# EAGLE design ybox2 (EAGLE 5.08)
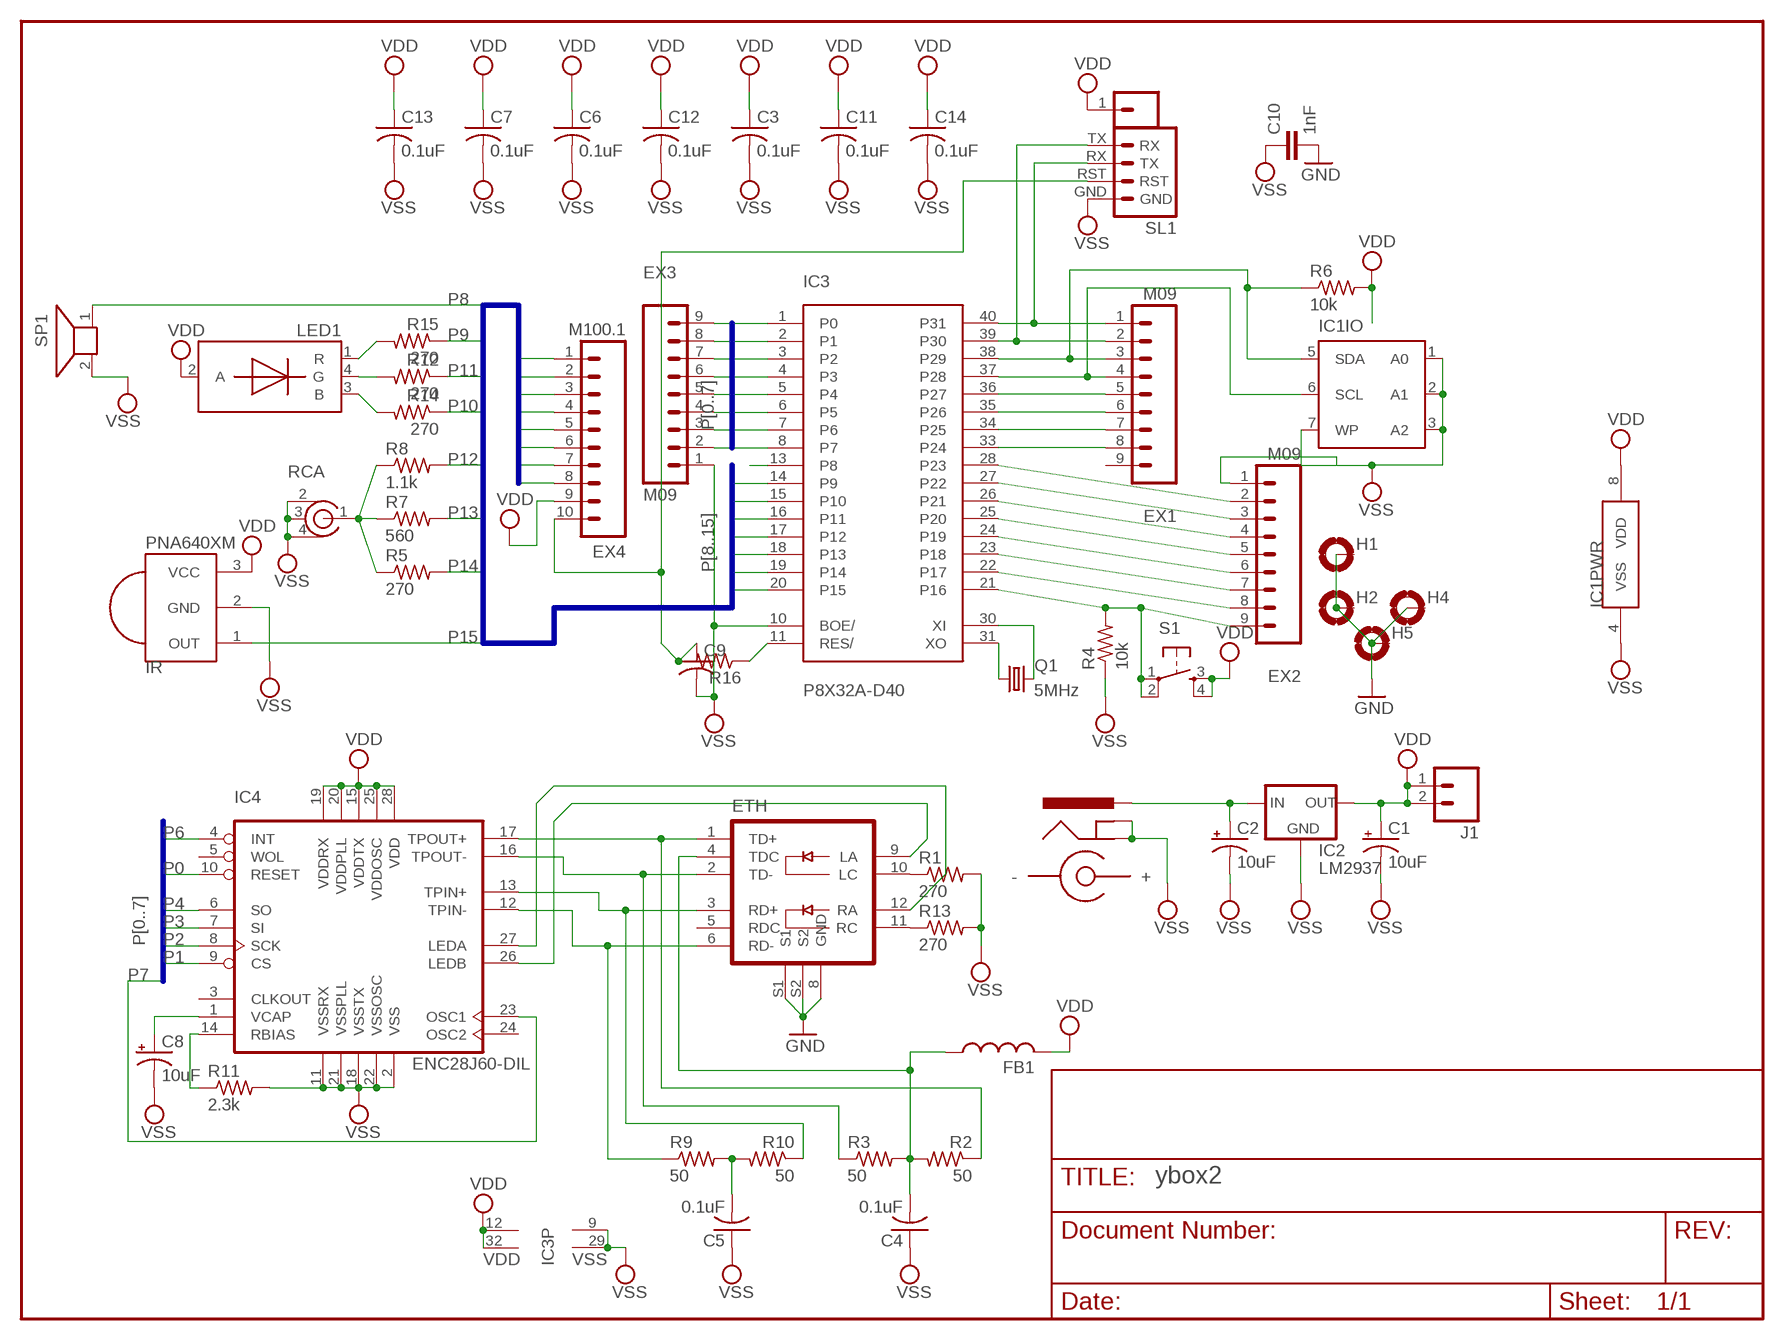
[diagram p0: schematic, sheet 1]

## Parts
C1  10uF  CAP_POLPTH2  [CPOL-RADIAL-10UF-25V]
C2  10uF  CAP_POLPTH2  [CPOL-RADIAL-10UF-25V]
C3  0.1uF  C-US025-024X044  [C025-024X044]
C4  0.1uF  C-US025-024X044  [C025-024X044]
C5  0.1uF  C-US025-024X044  [C025-024X044]
C6  0.1uF  C-US025-024X044  [C025-024X044]
C7  0.1uF  C-US025-024X044  [C025-024X044]
C8  10uF  CAP_POLPTH2  [CPOL-RADIAL-10UF-25V]
C9  C-US025-024X044  [C025-024X044]
C10  1nF  C-EU025-024X044  [C025-024X044]
C11  0.1uF  C-US025-024X044  [C025-024X044]
C12  0.1uF  C-US025-024X044  [C025-024X044]
C13  0.1uF  C-US025-024X044  [C025-024X044]
C14  0.1uF  C-US025-024X044  [C025-024X044]
ETH  J00-0065NL  J0026  [PJ-J0]
EX1  M09  [1X09]
EX2  M09  [1X09]
EX3  M09  [1X09]
EX4  M100.1  [1X10]
FB1  L-US0207/2V  [0207/2V]
H1  MOUNT-PAD-ROUND2.8  [2,8-PAD]
H2  MOUNT-PAD-ROUND2.8  [2,8-PAD]
H4  MOUNT-PAD-ROUND2.8  [2,8-PAD]
H5  MOUNT-PAD-ROUND2.8  [2,8-PAD]
IC1  24LC256AA65P  [DIL8]
IC2  LM2937  V_REG_78XXSIDE  [78XXL]
IC3  P8X32A-D40  P8X32AD40  [DIP40]
IC4  ENC28J60-DIL  [DIL28-3]
IR  PNA640XM  [PNA460XM]
J1  M02PTH  [1X02]
LED1  LED-RGB-CA  [LED5MMRGB]
PWR  POWER_JACKPTH  [POWER_JACK_PTH]
Q1  5MHz  CRYSTALHC49UV  [HC49U-V]
R1  270  R-US_0204/7  [0204/7]
R2  50  R-US_0204/2V  [0204V]
R3  50  R-US_0204/2V  [0204V]
R4  10k  R-US_0204/7  [0204/7]
R5  270  R-US_0204/7  [0204/7]
R6  10k  R-US_0204/7  [0204/7]
R7  560  R-US_0204/7  [0204/7]
R8  1.1k  R-US_0204/7  [0204/7]
R9  50  R-US_0204/2V  [0204V]
R10  50  R-US_0204/2V  [0204V]
R11  2.3k  R-US_0204/7  [0204/7]
R12  270  R-US_0207/10  [0207/10]
R13  270  R-US_0204/7  [0204/7]
R14  270  R-US_0207/10  [0207/10]
R15  270  R-US_0207/10  [0207/10]
R16  R-US_0204/7  [0204/7]
RCA  RCA-JACK  [RJC-014]
S1  TAC_SWITCHPTH  [TACTILE-PTH]
SL1  PROPPLUGCLIP  [PROPCLIP]
SP1  SPEAKER/AL60P  [AL60P]
U$1  6V  POLARITY  [CENTER-POS]
VDD  M01PTH  [1X01]

## Nets
6V: C2.1(+) IC2.IN PWR.PWR
GND: C10.2 ETH.8(GND) ETH.S1 ETH.S2 H1.B2,8(MOUNT) H2.B2,8(MOUNT) H4.B2,8(MOUNT) H5.B2,8(MOUNT)
N$1: EX1.2 IC3.39(P30) SL1.TX(RX)
N$2: EX1.1 IC3.40(P31) SL1.RX(TX)
N$4: IC3.31(XO) Q1.1
N$5: C5.2 R9.2 R10.2
N$6: LED1.1(R) R15.2
N$7: EX1.3 IC1.5(IO:SDA) IC3.38(P29) R6.1
N$8: EX1.4 IC1.6(IO:SCL) IC3.37(P28)
N$9: LED1.3(B) R14.2
N$10: LED1.4(G) R12.2
N$11: IC3.11(RES/) R16.1
N$12: C9.1 EX4.10 R16.2 SL1.RST
N$19: R5.1 R7.1 R8.1 RCA.1(SIG)
N$21: ETH.3(RD+) IC4.13(TPIN+) R10.1
N$22: ETH.6(RD-) IC4.12(TPIN-) R9.1
N$23: ETH.2(TD-) IC4.16(TPOUT-) R3.1
N$24: ETH.1(TD+) IC4.17(TPOUT+) R2.1
N$25: EX1.5 IC3.36(P27)
N$26: IC3.30(XI) Q1.2
N$28: IC4.14(RBIAS) R11.1
N$29: C8.1(+) IC4.1(VCAP)
N$36: EX1.6 IC3.35(P26)
N$38: EX1.7 IC3.34(P25)
N$39: EX1.8 IC3.33(P24)
N$40: EX2.8 IC3.22(P17)
N$41: EX2.7 IC3.23(P18)
N$42: EX2.6 IC3.24(P19)
N$43: EX2.5 IC3.25(P20)
N$44: EX2.4 IC3.26(P21)
N$45: EX2.3 IC3.27(P22)
N$46: EX2.2 IC3.28(P23)
N$49: ETH.12(RA) IC4.27(LEDA)
N$50: ETH.9(LA) IC4.26(LEDB)
N$51: ETH.10(LC) R1.1
N$52: ETH.11(RC) R13.1
N$53: C4.2 ETH.4(TDC) FB1.1 R2.2 R3.2
P0: EX3.9 IC3.1(P0) IC4.10(RESET)
P1: EX3.8 IC3.2(P1) IC4.9(CS)
P2: EX3.7 IC3.3(P2) IC4.8(SCK)
P3: EX3.6 IC3.4(P3) IC4.7(SI)
P4: EX3.5 IC3.5(P4) IC4.6(SO)
P5: EX3.4 IC3.6(P5)
P6: EX3.3 IC3.7(P6) IC4.4(INT)
P7: EX3.2 IC3.8(P7) IC4.23(OSC1)
P8: EX4.8 IC3.13(P8) SP1.1(+)
P9: EX4.7 IC3.14(P9) R15.1
P10: EX4.6 IC3.15(P10) R14.1
P11: EX4.5 IC3.16(P11) R12.1
P12: EX4.4 IC3.17(P12) R8.2
P13: EX4.3 IC3.18(P13) R7.2
P14: EX4.2 IC3.19(P14) R5.2
P15: EX4.1 IC3.20(P15) IR.1(OUT)
P16: EX2.9 IC3.21(P16) R4.2 S1.1 S1.2
VDD: C1.1(+) C3.1 C6.1 C7.1 C11.1 C12.1 C13.1 C14.1 EX4.9 FB1.2 IC1.8(PWR:VDD) IC2.OUT IC3.12(VDD) IC3.32(VDD) IC4.15(VDDTX) IC4.19(VDDRX) IC4.20(VDDPLL) IC4.25(VDDOSC) IC4.28(VDD) IR.3(VCC) J1.1 J1.2 LED1.2(A) R6.2 S1.3 S1.4 VDD.1
VSS: C1.2(-) C2.2(-) C3.2 C4.1 C5.1 C6.2 C7.2 C8.2(-) C9.2 C10.1 C11.2 C12.2 C13.2 C14.2 EX2.1 EX3.1 IC1.1(IO:A0) IC1.2(IO:A1) IC1.3(IO:A2) IC1.4(PWR:VSS) IC1.7(IO:WP) IC2.GND IC3.9(VSS) IC3.10(BOE/) IC3.29(VSS) IC4.2(VSS) IC4.11(VSSRX) IC4.18(VSSTX) IC4.21(VSSPLL) IC4.22(VSSOSC) IR.2(GND) PWR.GND PWR.GNDBREAK R1.2 R4.1 R11.2 R13.2 RCA.2(GND1) RCA.3(GND2) RCA.4(GND3) SL1.GND SP1.2(-)
Unconnected: ETH.5(RDC) EX1.9 IC4.3(CLKOUT) IC4.5(WOL) IC4.24(OSC2)

## Buses
P[0..7]
P[8..15]

## Notes on the sheet
- - | +
- ybox2

## Library data of the parts
C1 C2 C8 = SparkFunEagle-6-6-07:CAP_POL: Capacitor Polarized These are standard SMD and PTH capacitors. Normally 10uF, 47uF, and 100uF in electrolytic and tantalum varieties. Always verify the external diameter of the through hole cap, it varies with capacity, voltage, and manufacturer. The EIA devices should be standard.
C3-C7 C9 C11-C14 = rcl:C-US: CAPACITOR, American symbol
C10 = rcl:C-EU: CAPACITOR, European symbol
ETH = con-pulse:J0026: RJ45 PulseJack w/LEDs
EX1-EX3 = SparkFunEagle-6-6-07:M09: Header 9 Standard 9-pin 0.1" header. Use with straight break away headers (SKU : PRT-00116), right angle break away headers (PRT-00553), swiss pins (PRT-00743), machine pins (PRT-00117), and female headers (PRT-00115).
EX4 = SparkFunEagle-6-6-07:M10: Header 10 Standard 10-pin 0.1" header. Use with straight break away headers (SKU : PRT-00116), right angle break away headers (PRT-00553), swiss pins (PRT-00743), machine pins (PRT-00117), and female headers (PRT-00115).
FB1 = 0common:L-US: INDUCTOR, American symbol
H1 H2 H4 H5 = holes:MOUNT-PAD-ROUND: MOUNTING PAD, round
IC1 = 0common:24LC256: Serial EEPROM 32 K/64 K, 1.8 V, I2C
IC2 = SparkFunEagle-6-6-07:V_REG_78XX: Voltage Regulator Standard 7805 5V regulator. IGO (Input Ground Output). Spark Fun Electronics SKU : COM-00107
IC3 = 0common:P8X32A
IC4 = microchip-enc28j60:ENC28J60-*: Microchip 10Mbit Eth. contoller with SPI interface
IR = 0common:PNA640XM
J1 = SparkFunEagle-6-6-07:M02: Header 2 Standard 2-pin 0.1" header. Use with straight break away headers (SKU : PRT-00116), right angle break away headers (PRT-00553), swiss pins (PRT-00743), machine pins (PRT-00117), and female headers (PRT-00115). Molex polarized connector foot print use with SKU : PRT-08233 with associated crimp pins and housings.
LED1 = 0common:LED-RGB-CA
PWR = SparkFunEagle-6-6-07:POWER_JACK: Power Jack This is the standard 5.5mm barrel jack for power. The PTH is the most common, proven, reliable, footprint. All others are experimental. The Slot footprint only works if the mill layer is transmitted to the PCB fab house so be warned. Spark Fun Electronics SKU : PRT-00119. Mating wall wart : TOL-00298 (and others)
Q1 = SparkFunEagle-6-6-07:CRYSTAL: Crystals Various standard crystals. Proven footprints. Spark Fun Electronics SKU : COM-00534
R1 R4-R8 R12-R16 = 0common:R-US_: RESISTOR, American symbol
R2 R3 R9-R11 = rcl:R-US_: RESISTOR, American symbol
RCA = 0common:RCA-JACK
S1 = 0common:TAC_SWITCH: Momentary Switch Button commonly used for reset or general input. Spark Fun Electronics SKU : COM-00097
SL1 = 0common:PROPPLUG: Header 4 Standard 4-pin 0.1" header. Use with straight break away headers (SKU : PRT-00116), right angle break away headers (PRT-00553), swiss pins (PRT-00743), machine pins (PRT-00117), and female headers (PRT-00115). Molex polarized connector foot print use with SKU : PRT-08231 with associated crimp pins and housings.
SP1 = 0common:SPEAKER: SPEAKER Source: Buerklin
U$1 = 0common:POLARITY
VDD = SparkFunEagle-6-6-07:M01: Header 1 Standard 1-pin 0.1" header. Use with straight break away headers (SKU : PRT-00116), right angle break away headers (PRT-00553), swiss pins (PRT-00743), machine pins (PRT-00117), and female headers (PRT-00115).

## Net classes
0 default: width 0.406 mm

## Board
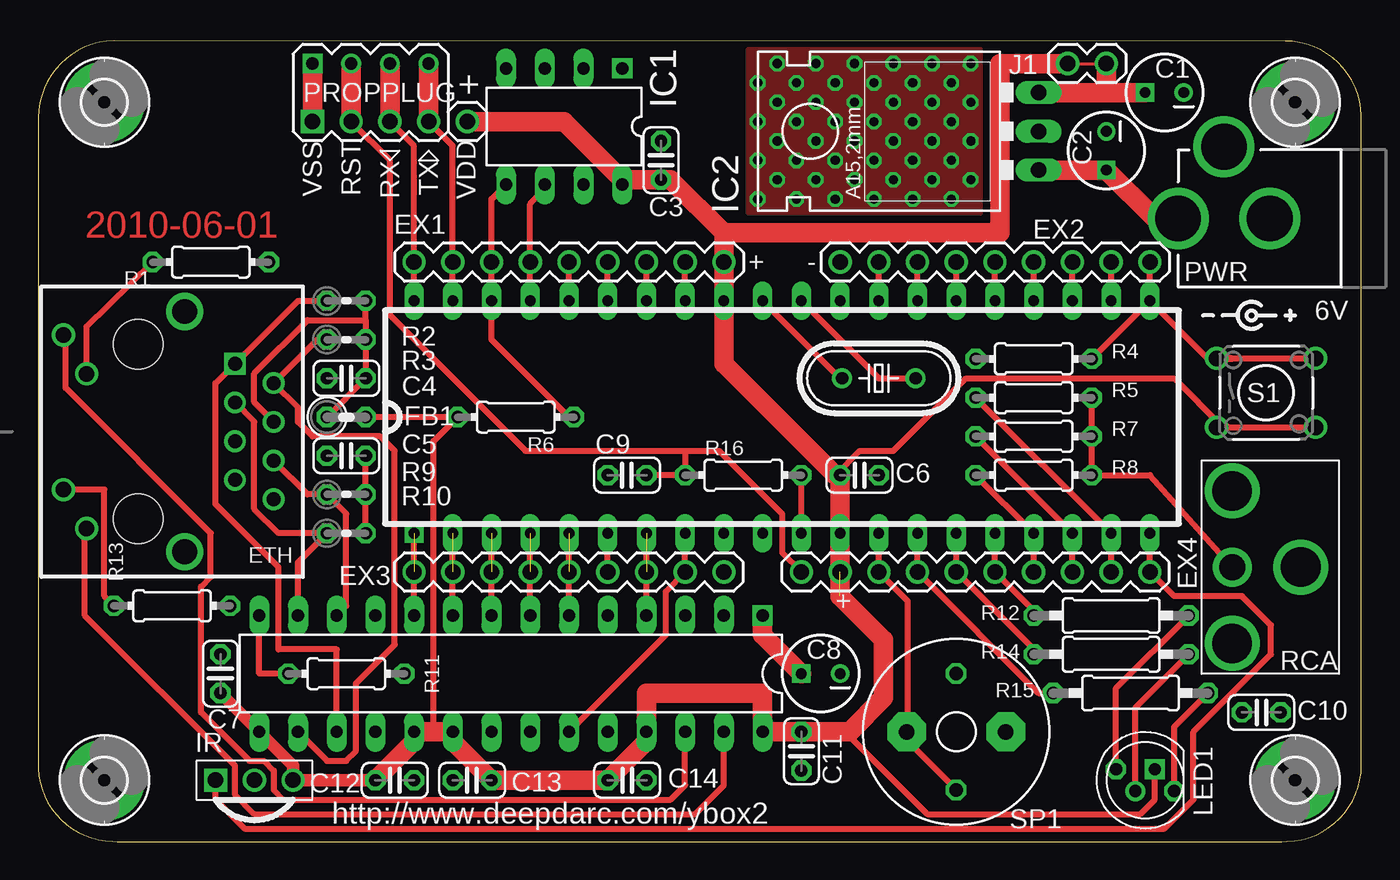
[diagram p1: board, top side]
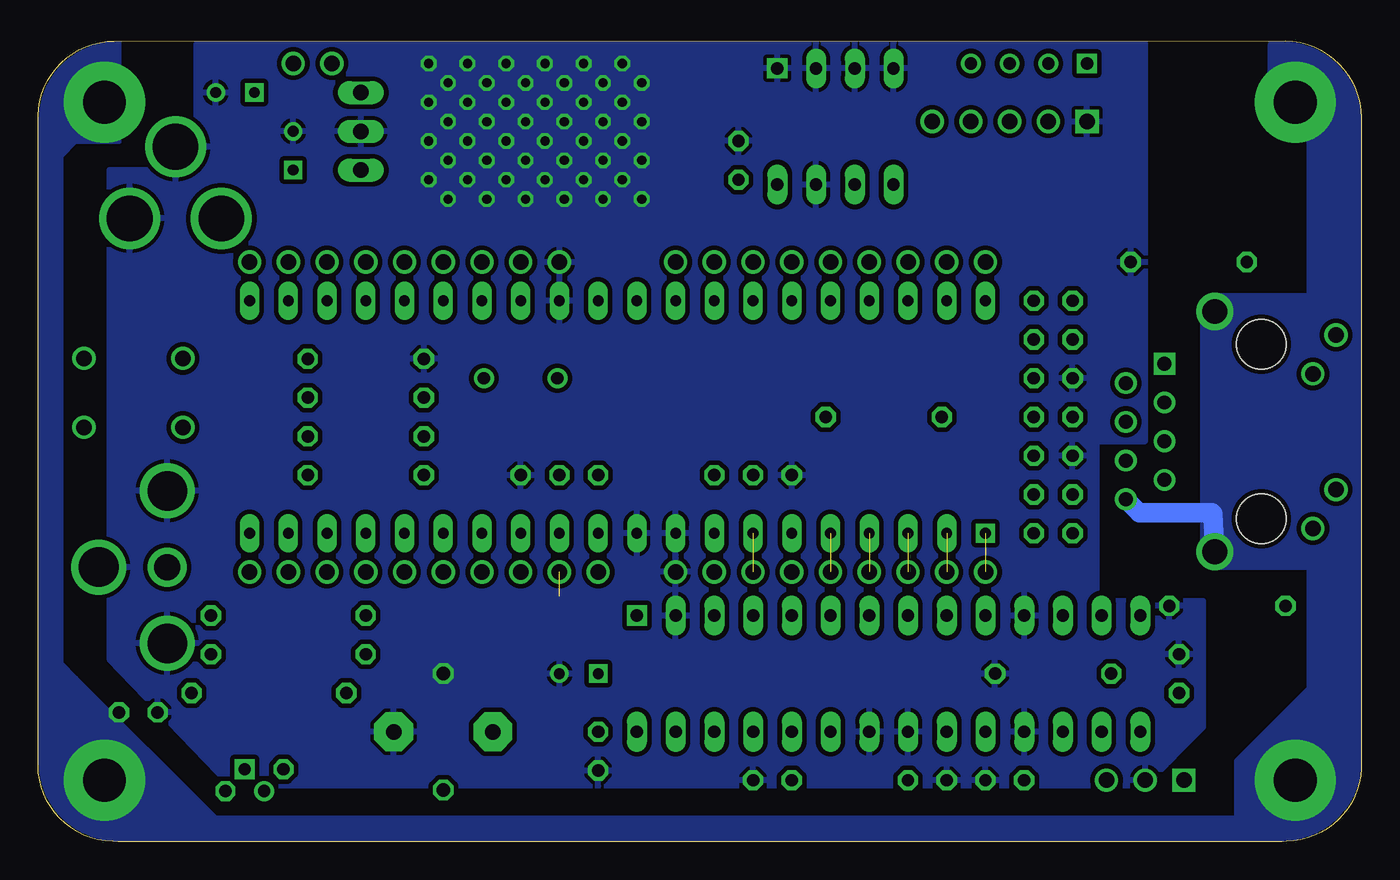
[diagram p2: board, bottom side, seen from below]

Size 86.79 x 52.5 mm. Coordinates in mm from the lower left corner, seen from the top.
Outline: 5.2,0 81.58,0 81.91,0.01 arc89 86.79,5.01 86.79,47.29 86.78,47.59 arc89 81.79,52.48 4.99,52.5 arc89 0,47.46 0,47.28 0.01,5.27 arc92 4.9,0.01 5.2,0
Copper layers (1*16): Top 0.035mm / dielectric 1.5mm / Bottom 0.035mm
Design rules "default": minimum track width 8mil, minimum drill 24mil, track to track 8mil, track to pad 8mil, pad to pad 8mil, via to via 8mil, smd to smd 8mil, copper to edge 0mil, drill to drill 8mil, minimum pad ring 10mil, minimum via ring 8mil, stop-mask expansion 4mil, vias tented up to drill 0mil, thermal gap 10mil

### Footprints (pad centres in the part's own frame; a part is rotated, then mirrored left to right if it is on the bottom)
CPOL-RADIAL-10UF-25V = drill 0.7 square: 1 1.27,0 | drill 0.7 round: 2 -1.27,0
C025-024X044 = drill 0.813 octagon: 1 -1.27,0; 2 1.27,0
PJ-J0 = drill 0.914 square: 1 4.445,-6.35 | drill 0.914 round: 2 3.175,-8.89; 3 1.905,-6.35; 4 0.635,-8.89; 5 -0.635,-6.35; 6 -1.905,-8.89; 7 -3.175,-6.35; 8 -4.445,-8.89 | drill 1.016 round: 9 6.325,4.902; 10 3.785,3.378; 11 -3.81,4.902; 12 -6.35,3.378 | drill 1.626 round: S1 -7.874,-3.048; S2 7.874,-3.048 | hole 3.251: -5.715,0; 5.715,0
1X09 = drill 1.016 round: 1 0,0; 2 2.54,0; 3 5.08,0; 4 7.62,0; 5 10.16,0; 6 12.7,0; 7 15.24,0; 8 17.78,0; 9 20.32,0
1X10 = drill 1.016 round: 1 0,0; 2 2.54,0; 3 5.08,0; 4 7.62,0; 5 10.16,0; 6 12.7,0; 7 15.24,0; 8 17.78,0; 9 20.32,0; 10 22.86,0
0207/2V = drill 0.813 octagon: 1 -1.27,0; 2 1.27,0
2,8-PAD = drill 2.8 pad 5.334 round: B2,8 0,0
DIL8 = drill 0.813 square: 1 -3.81,-3.81 | drill 0.813 long: 2 -1.27,-3.81; 3 1.27,-3.81; 4 3.81,-3.81; 5 3.81,3.81; 6 1.27,3.81; 7 -1.27,3.81; 8 -3.81,3.81
78XXL = drill 1.016 long: GND 0,-3.81; IN -2.54,-3.81; OUT 2.54,-3.81
DIP40 = drill 0.7 pad 1.27 square: 1 -7.62,23.495 | drill 0.7 pad 1.27 long: 2 -7.62,20.955; 3 -7.62,18.415; 4 -7.62,15.875; 5 -7.62,13.335; 6 -7.62,10.795; 7 -7.62,8.255; 8 -7.62,5.715; 9 -7.62,3.175; 10 -7.62,0.635; 11 -7.62,-1.905; 12 -7.62,-4.445; 13 -7.62,-6.985; 14 -7.62,-9.525; 15 -7.62,-12.065; 16 -7.62,-14.605; 17 -7.62,-17.145; 18 -7.62,-19.685; 19 -7.62,-22.225; 20 -7.62,-24.765; 21 7.62,-24.765; 22 7.62,-22.225; 23 7.62,-19.685; 24 7.62,-17.145; 25 7.62,-14.605; 26 7.62,-12.065; 27 7.62,-9.525; 28 7.62,-6.985; 29 7.62,-4.445; 30 7.62,-1.905; 31 7.62,0.635; 32 7.62,3.175; 33 7.62,5.715; 34 7.62,8.255; 35 7.62,10.795; 36 7.62,13.335; 37 7.62,15.875; 38 7.62,18.415; 39 7.62,20.955; 40 7.62,23.495
DIL28-3 = drill 0.813 square: 1 -16.51,-3.81 | drill 0.813 long: 2 -13.97,-3.81; 3 -11.43,-3.81; 4 -8.89,-3.81; 5 -6.35,-3.81; 6 -3.81,-3.81; 7 -1.27,-3.81; 8 1.27,-3.81; 9 3.81,-3.81; 10 6.35,-3.81; 11 8.89,-3.81; 12 11.43,-3.81; 13 13.97,-3.81; 14 16.51,-3.81; 15 16.51,3.81; 16 13.97,3.81; 17 11.43,3.81; 18 8.89,3.81; 19 6.35,3.81; 20 3.81,3.81; 21 1.27,3.81; 22 -1.27,3.81; 23 -3.81,3.81; 24 -6.35,3.81; 25 -8.89,3.81; 26 -11.43,3.81; 27 -13.97,3.81; 28 -16.51,3.81
PNA460XM = drill 1.016 square: 1 -2.54,0 | drill 1.016 round: 2 0,0; 3 2.54,0
1X02 = drill 1.016 round: 1 0,0; 2 2.54,0
LED5MMRGB = drill 0.8 pad 0.813 octagon: 1 -1.905,0.714; 4 1.905,-0.714 | drill 0.8 pad 0.813 square: 2 -0.635,-0.714 | drill 0.8 pad 0.813 round: 3 0.635,0.714
POWER_JACK_PTH = drill 2.997 round: GND 0,7.7; GNDBREAK 4.7,10.7; PWR 0,13.7
HC49U-V = drill 0.813 round: 1 -2.413,0; 2 2.413,0
0204/7 = drill 0.813 octagon: 1 -3.81,0; 2 3.81,0
0204V = drill 0.813 octagon: 1 -1.27,0; 2 1.27,0
0207/10 = drill 0.813 octagon: 1 -5.08,0; 2 5.08,0
RJC-014 = drill 1.7 round: 1 0,0 | drill 2.6 round: 2 -4.5,0; 3 0,5; 4 0,-5
TACTILE-PTH = drill 1.016 round: 1 -3.251,2.261; 2 3.251,2.261; 3 -3.251,-2.261; 4 3.251,-2.261
PROPCLIP = drill 1.016 square: GND 0,0 | drill 0.8 square: P$1 0,3.81 | drill 0.8 round: P$2 2.54,3.81; P$3 5.08,3.81; P$4 7.62,3.81 | drill 1.016 round: RST 2.54,0; RX 5.08,0; TX 7.62,0
AL60P = drill 1.016 pad 2.54 octagon: 1 -3.251,0; 2 3.251,0
1X01 = drill 1.016 round: 1 0,0

### Placement (x,y rotation side)
C1  73.87,49.11 180 top
C2  70.06,45.3 270 top
C3  40.85,44.66 90 top
C4  20.21,30.37 0 top
C5  20.21,25.29 0 top
C6  53.87,24.02 0 top
C7  11.96,11.01 90 top
C8  51.33,11.01 180 top
C9  38.63,24.02 180 top
C10  80.22,8.47 0 top
C11  50.06,5.93 270 top
C12  23.39,4.02 0 top
C13  28.47,4.02 180 top
C14  38.63,4.02 0 top
ETH  6.56,26.88 90 top
EX1  24.66,37.99 0 top
EX2  52.6,37.99 0 top
EX3  44.98,17.67 180 top
EX4  72.92,17.67 180 top
FB1  20.21,27.83 0 top
H1  4.34,48.47 0 top
H2  82.44,48.47 0 top
H4  4.34,4.02 0 top
H5  82.44,4.02 0 top
IC1  34.5,46.88 180 top
IC2  61.81,46.57 90 top
IC3  48.15,27.83 90 top
IC4  31.01,11.01 180 top
IR  14.18,4.02 0 top
J1  67.52,51.01 0 top
LED1  72.6,4.02 180 top
PWR  88.48,40.85 90 top
Q1  55.14,30.37 0 top
R1  11.32,37.99 0 top
R2  20.21,35.45 0 top
R3  20.21,32.91 0 top
R4  65.3,31.64 0 top
R5  65.3,29.1 180 top
R6  31.33,27.83 180 top
R7  65.3,26.56 180 top
R8  65.3,24.02 180 top
R9  20.21,22.75 0 top
R10  20.21,20.21 0 top
R11  20.21,11.01 0 top
R12  70.38,14.82 0 top
R13  8.78,15.45 0 top
R14  70.38,12.28 0 top
R15  71.65,9.74 0 top
R16  46.25,24.02 180 top
RCA  78.32,17.99 180 top
S1  80.54,29.42 0 top
SL1  17.99,47.2 0 top
SP1  60.22,7.2 0 top
U$1  79.59,34.5 0 top
VDD  28.15,47.2 0 top

### Tracks (layer width: path | path; a pad name or v marks a point on that pad's centre or on a via)
6V
  Top 1.27: PWR.PWR 73.24,40.85 C2.1 IC2.IN
GND
  Bottom 1.27: ETH.S1 9.74,21.48 9.8,21.55 14.56,21.55 ETH.8
  pour Bottom (isolate 0.305, no thermals): 8.15,0.21 8.15,5.29 3.39,10.05 3.39,17.99 9.74,17.99 10.37,18.63 10.37,34.82 9.42,35.77 3.39,35.77 3.39,46.88 5.93,46.88 5.93,52.28 5.21,52.28 arc90 0.21,47.28 0.21,5.21 arc90 5.21,0.21
  pour Bottom (isolate 0.305, no thermals): 81.49,52.28 81.57,52.28 arc-90 86.57,47.28 86.57,5.21 arc-90 81.57,0.21 6.24,0.21 6.24,1.48 75.14,1.48 84.35,10.69 85.3,11.64 85.3,44.98 84.35,45.93 81.49,45.93
N$1
  Top 0.406: SL1.TX 27.2,45.61 EX1.2 IC3.39
N$2
  Top 0.406: SL1.RX 24.66,45.61 EX1.1 IC3.40
N$4
  Top 0.406: 52.92,30.37 Q1.1 52.6,30.37 IC3.31
N$5
  Top 0.406: R9.2 R10.2 C5.2
N$6
  Top 0.406: LED1.1 74.51,7.51 R15.2
N$7
  Top 0.406: R6.1 34.82,27.83 29.74,32.91 IC3.38 EX1.3 29.74,42.12 IC1.5
N$8
  Top 0.406: IC3.37 EX1.4 32.28,41.8 33.55,43.07 IC1.6
N$9
  Top 0.406: LED1.3 71.97,8.78 R14.2
N$10
  Top 0.406: LED1.4 70.7,10.05 R12.2
N$11
  Top 0.406: IC3.11 R16.1
N$12
  Top 0.406: SL1.RST 23.07,44.66 23.07,34.5 31.96,25.61 42.44,25.61 | 42.44,25.61 44.66,25.61 48.79,21.48 48.79,18.94 EX4.10 | 42.44,25.61 R16.2 C9.1
N$19
  Top 0.406: R5.1 R7.1 R8.1 72.92,24.02 RCA.1
N$21
  Top 0.406: ETH.3 14.18,27.52 14.18,21.8 15.77,20.21 R10.1 17.04,18.31 IC4.13
N$22
  Top 0.406: IC4.12 20.21,15.45 20.21,21.48 R9.1 17.67,22.75 ETH.6
N$23
  Top 0.406: R3.1 18.31,32.91 ETH.2 17.04,28.47 17.04,27.52 17.99,26.56 22.44,26.56 23.39,25.61 23.39,12.91 20.85,10.37 20.85,5.93 20.21,5.29 18.94,5.29 IC4.16
N$24
  Top 0.406: R2.1 17.04,35.45 ETH.1 11.64,30.06 11.64,22.12 15.77,17.99 15.77,12.59 19.58,12.59 IC4.17
N$25
  Top 0.406: IC3.36 EX1.5
N$26
  Top 0.406: 57.68,30.37 Q1.2 55.14,30.37 IC3.30
N$28
  Top 0.406: R11.1 14.5,11.01 IC4.14
N$29
  Top 1.27: C8.1 47.52,13.55 IC4.1
N$36
  Top 0.406: IC3.35 EX1.6
N$38
  Top 0.406: IC3.34 EX1.7
N$39
  Top 0.406: IC3.33 EX1.8
N$40
  Top 0.406: IC3.22 EX2.8
N$41
  Top 0.406: IC3.23 EX2.7
N$42
  Top 0.406: IC3.24 EX2.6
N$43
  Top 0.406: IC3.25 EX2.5
N$44
  Top 0.406: IC3.26 EX2.4
N$45
  Top 0.406: IC3.27 EX2.3
N$46
  Top 0.406: IC3.28 EX2.2
N$49
  Top 0.406: IC4.27 44.98,3.7 43.07,1.8 14.18,1.8 12.91,3.07 12.91,4.97 3.07,14.82 3.07,20.42 ETH.12
N$50
  Top 0.406: IC4.26 42.44,3.7 41.49,2.75 16.09,2.75 15.45,3.39 15.45,4.66 14.82,5.29 13.86,5.29 10.69,8.47 10.69,16.72 11.32,17.36 11.32,20.21 1.8,29.74 1.8,32.91 1.51,33.21 | 1.51,33.21 1.48,33.23 | 1.51,33.21 ETH.9
N$51
  Top 0.406: ETH.10 3.18,33.75 R1.1
N$52
  Top 0.406: ETH.11 4.34,23.07 4.34,16.09 R13.1
N$53
  Top 0.406: 21.48,34.18 R2.2 | 21.48,34.18 R3.2 C4.2 FB1.1 | ETH.4 14.18,28.79 14.18,30.69 17.67,34.18 21.48,34.18
P0  (1 unrouted)
  Top 0.406: IC4.10 IC3.1
P1  (1 unrouted)
  Top 0.406: IC4.9 IC3.2
P2  (1 unrouted)
  Top 0.406: IC4.8 IC3.3
P3  (1 unrouted)
  Top 0.406: IC4.7 IC3.4
P4  (1 unrouted)
  Top 0.406: IC4.6 IC3.5
P5
  Top 0.406: EX3.4 IC3.6
P6  (1 unrouted)
  Top 0.406: IC4.4 IC3.7
P7
  Top 0.406: IC3.8 EX3.2 41.17,16.4 41.17,13.55 IC4.23
P8  (via drill 0.89)
  Top 0.406: v60.22,3.39 57.04,6.56 SP1.1 57.04,7.2 57.04,15.77 55.46,17.36 55.14,17.36 EX4.8 IC3.13
P9
  Top 0.406: IC3.14 EX4.7 65.62,9.74 R15.1
P10
  Top 0.406: IC3.15 EX4.6 65.3,12.59 R14.1
P11
  Top 0.406: IC3.16 EX4.5 65.3,15.13 R12.1 65.3,14.5
P12
  Top 0.406: R8.2 IC3.17 EX4.4 65.3,17.36
P13
  Top 0.406: R7.2 IC3.18 EX4.3
P14
  Top 0.406: R5.2 IC3.19 EX4.2
P15
  Top 0.406: IR.1 11.64,2.75 13.55,0.85 73.87,0.85 75.78,2.75 75.78,7.2 80.86,12.28 80.86,14.18 78.95,16.09 74.51,16.09 EX4.1 IC3.20
P16
  Top 0.406: R4.2 IC3.21 | S1.2 78.35,31.68 78.32,31.64 | 78.32,31.64 78.28,31.68 S1.1 | IC3.21 76.73,31.64 78.32,31.64 | IC3.21 EX2.9
VDD  (1 unrouted)
  Top 0.203: J1.1 J1.2
  Top 0.406: 25.93,7.2 25.93,26.25 R6.2 FB1.2 | 78.04,27.16 S1.3 77.68,27.2 74.51,30.37 60.85,30.37 56.09,25.61 53.87,25.61 52.28,24.02 | 78.04,27.16 S1.4 | 78.04,27.16 78,27.2 | LED1.2 73.24,2.75 72.28,1.8 58.31,1.8 52.92,7.2 | 38.31,43.39 IC1.8
  Top 0.813: C7.1 IC4.15 16.72,4.97 IR.3 C12.1
  Top 1.27: VDD.1 34.5,47.2 38.31,43.39 C3.1 41.49,43.39 44.98,39.9 | C12.1 24.66,6.56 IC4.19 25.93,7.2 IC4.20 27.2,6.56 C13.1 C14.1 39.9,6.56 IC4.25 39.9,9.74 47.52,9.74 IC4.28 C11.1 52.92,7.2 53.23,7.2 55.46,9.42 55.46,13.23 52.6,16.09 IC3.12 C6.1 52.28,24.02 44.98,31.33 IC3.32 44.98,39.9 | J1.1 63.08,51.01 63.08,39.9 44.98,39.9 | 70.06,49.11 IC2.OUT | 70.06,49.11 C1.1 | J1.2 70.06,49.11
VSS  (via drill 0.6, 0.89)
  other vias: 60.22,11.01 48.47,51.01 51.01,51.01 53.55,51.01 56.09,51.01 58.63,51.01 61.17,51.01 61.17,48.47 58.63,48.47 56.09,48.47 53.55,48.47 51.01,48.47 48.47,48.47 48.47,45.93 53.55,45.93 56.09,45.93 58.63,45.93 61.17,45.93 61.17,43.39 58.63,43.39 56.09,43.39 53.55,43.39 51.01,43.39 48.47,43.39 49.74,42.12 52.28,42.12 54.82,42.12 57.36,42.12 59.9,42.12 59.9,44.66 57.36,44.66 54.82,44.66 52.28,44.66 49.74,44.66 49.74,47.2 52.28,47.2 54.82,47.2 57.36,47.2 59.9,47.2 59.9,49.74 57.36,49.74 54.82,49.74 52.28,49.74 49.74,49.74 51.01,45.93 47.2,49.74 47.2,47.2 47.2,44.66 47.2,42.12
  pour Bottom (isolate 0.305): 10.37,15.77 17.36,15.77 17.36,26.25 14.18,26.25 14.18,52.28 76.41,52.28 76.41,44.03 82.13,44.03 82.13,11.96 74.19,3.7 14.18,3.7 10.37,7.51
  pour Top (no thermals): 46.57,51.96 61.81,51.96 61.81,41.17 46.57,41.17

### Text on the board
Top: 2010-06-01
tPlace: C1 | + | C2 | - | + | PWR | + | C8
tNames: http://www.deepdarc.com/ybox2
tStop: 2010-06-01
_tsilk: J1 | C1 | PROPPLUG | + | IC1 | VSS | RST | VDD | RX | TX | IC2 | C2 | A15,2mm | LM2937 | C3 | EX1 | 2008-02-21 | EX2 | - | 270 | + | PWR | R1 | 50 | 6V | R2 | J00-0065NL | R4 | R3 | P8X32A-D40 | 10k | 270 | C4 | R5 | S1 | 10k | FB1 | R6 | 560 | R7 | 0.01uF | 5MHz | C5 | 1.1k | R9 | C6 | R8 | R10 | 50 | EX4 | ETH | EX3 | R13 | 270 | R12 | 270 | RCA | R11 | ENC28J60-DIL | C8 | R14 | 270 | 2k | C9 | R15 | C7 | 270 | C10 | C11 | IR | LED1 | C13 | C14 | C12 | http://www.deepdarc.com/ybox2 | SP1